# EAGLE design light-plate_control_v1.0 (EAGLE 6.2)

## Sheet 1 of 4
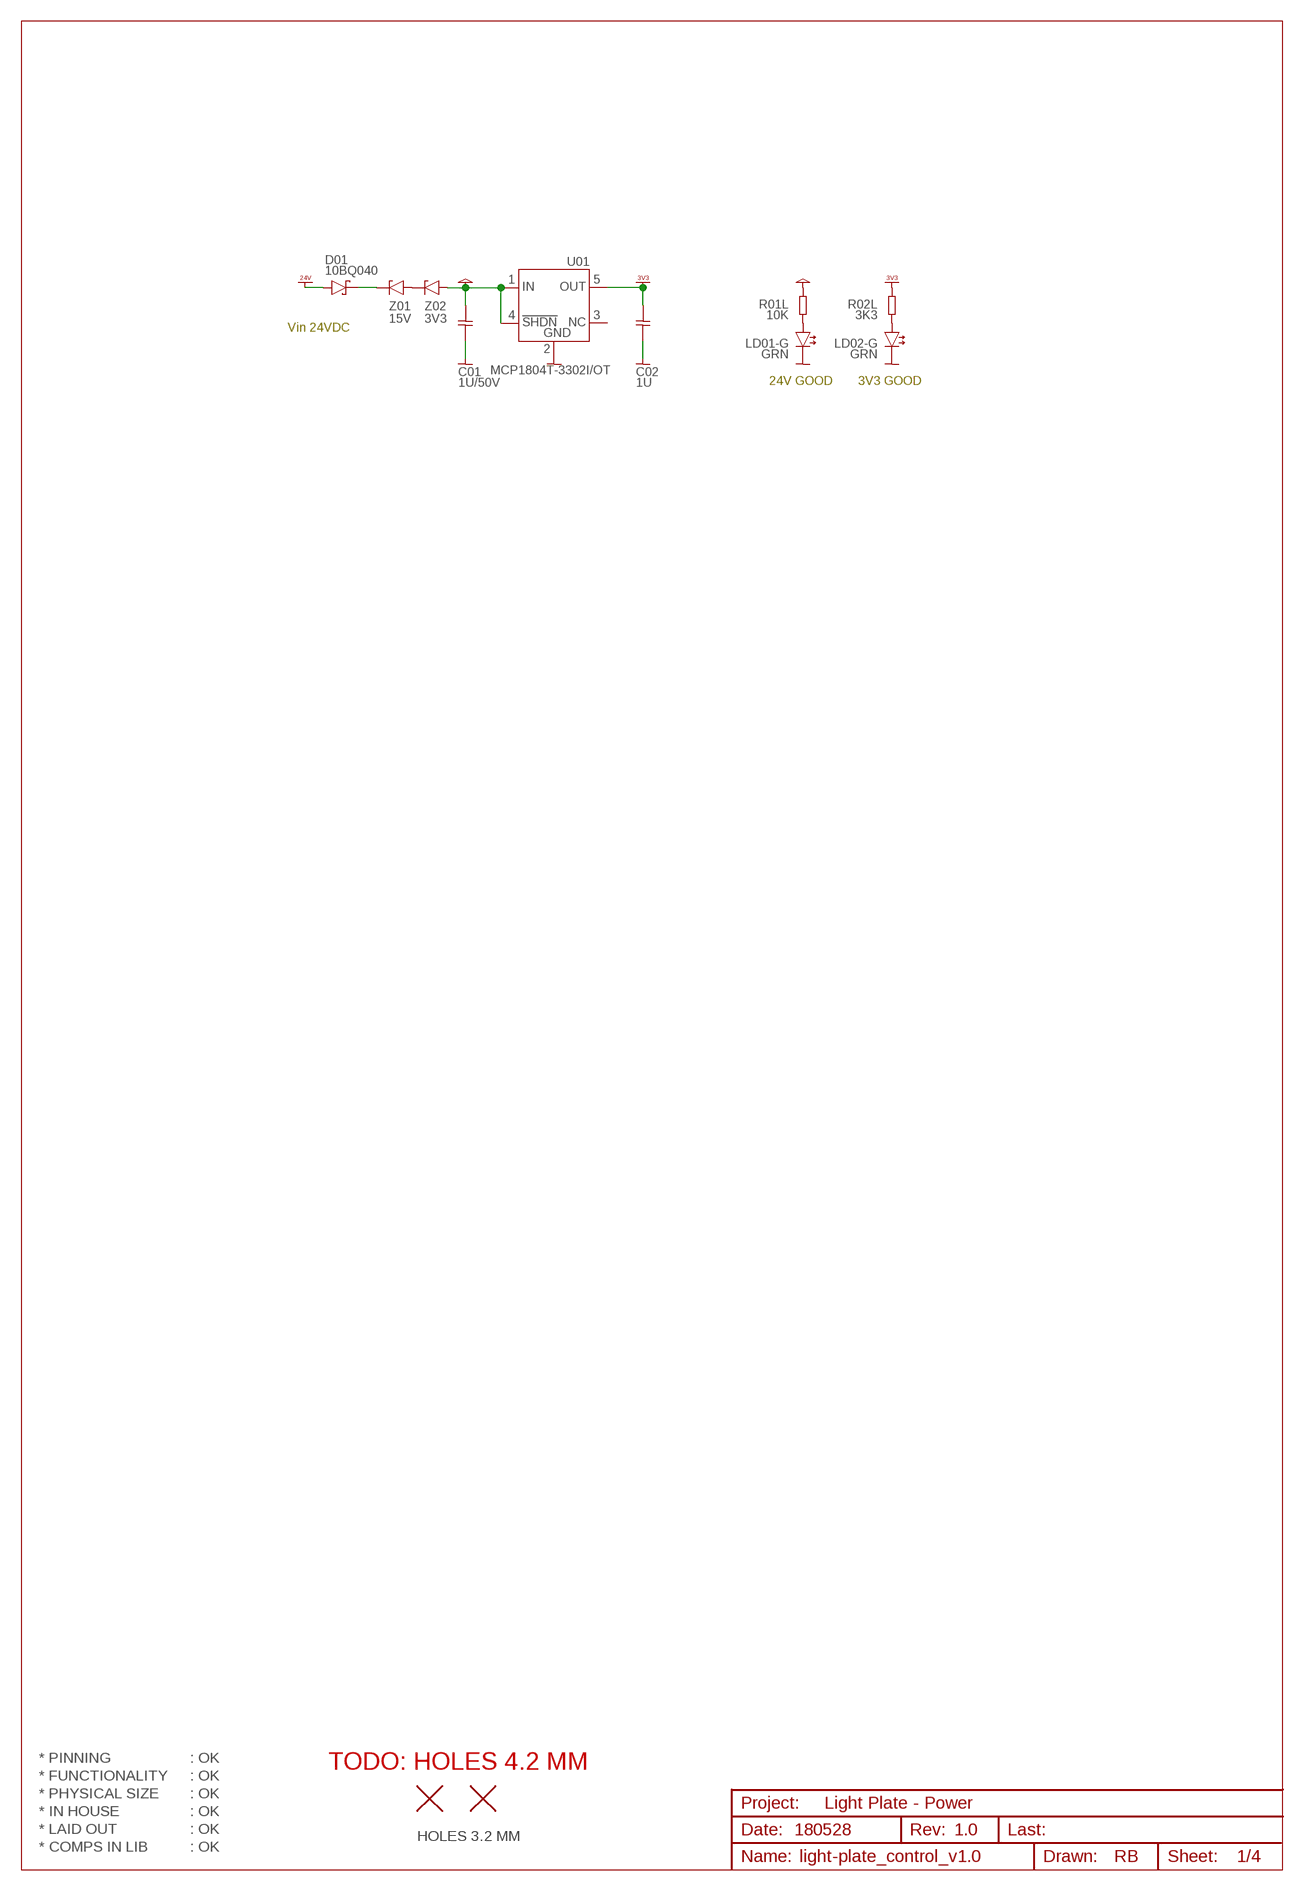
[diagram p0: schematic, sheet 1]

### Parts
C01  1U/50V  CAP0603  [CAP0603]
C02  1U  CAP0603  [CAP0603]
D01  10BQ040  DIODE_15MQ040  [DIODE_SMA]
H2  HOLE_NPTH_3.2MM  [HOLE_NPTH_3.2MM]
H3  HOLE_NPTH_3.2MM  [HOLE_NPTH_3.2MM]
LD01-G  GRN  LED_SMD_0603  [LED_SMD_0603]
LD02-G  GRN  LED_SMD_0603  [LED_SMD_0603]
R01L  10K  RES0603  [RES0603]
R02L  3K3  RES0603  [RES0603]
U01  MCP1804T-3302I/OT  [SOT23-5]
Z01  15V  ZENER_SOD80  [ZENER_SOD80]
Z02  3V3  ZENER_SOD80  [ZENER_SOD80]

### Nets
GND: C01.2 C02.2 LD01-G.C LD02-G.C U01.2(2.GND) ; also sheet 2,3,4
N$3: LD02-G.A R02L.2
N$25: LD01-G.A R01L.2
N$151: D01.C(-) Z01.2(-)
N$162: Z01.1(+) Z02.2(-)
VCC: C01.1 R01L.1 U01.1(1.IN) U01.4(4.SHDN) Z02.1(+)
VDD_3V3: C02.1 R02L.1 U01.5(5.OUT) ; supply symbol labelled VCC_3V3 ; also sheet 2
VDD_24V: D01.A(+) ; supply symbol labelled VCC_24V ; also sheet 2,3,4
Unconnected: U01.3(3.NC)

### Notes on the sheet
- Vin 24VDC
- 24V GOOD | 3V3 GOOD
- * PINNING | : OK
- TODO: HOLES 4.2 MM
- * FUNCTIONALITY | : OK
- * PHYSICAL SIZE | : OK
- Light Plate - Power
- * IN HOUSE | : OK
- * LAID OUT | : OK | 180528 | 1.0
- HOLES 3.2 MM
- * COMPS IN LIB | : OK

## Sheet 2 of 4
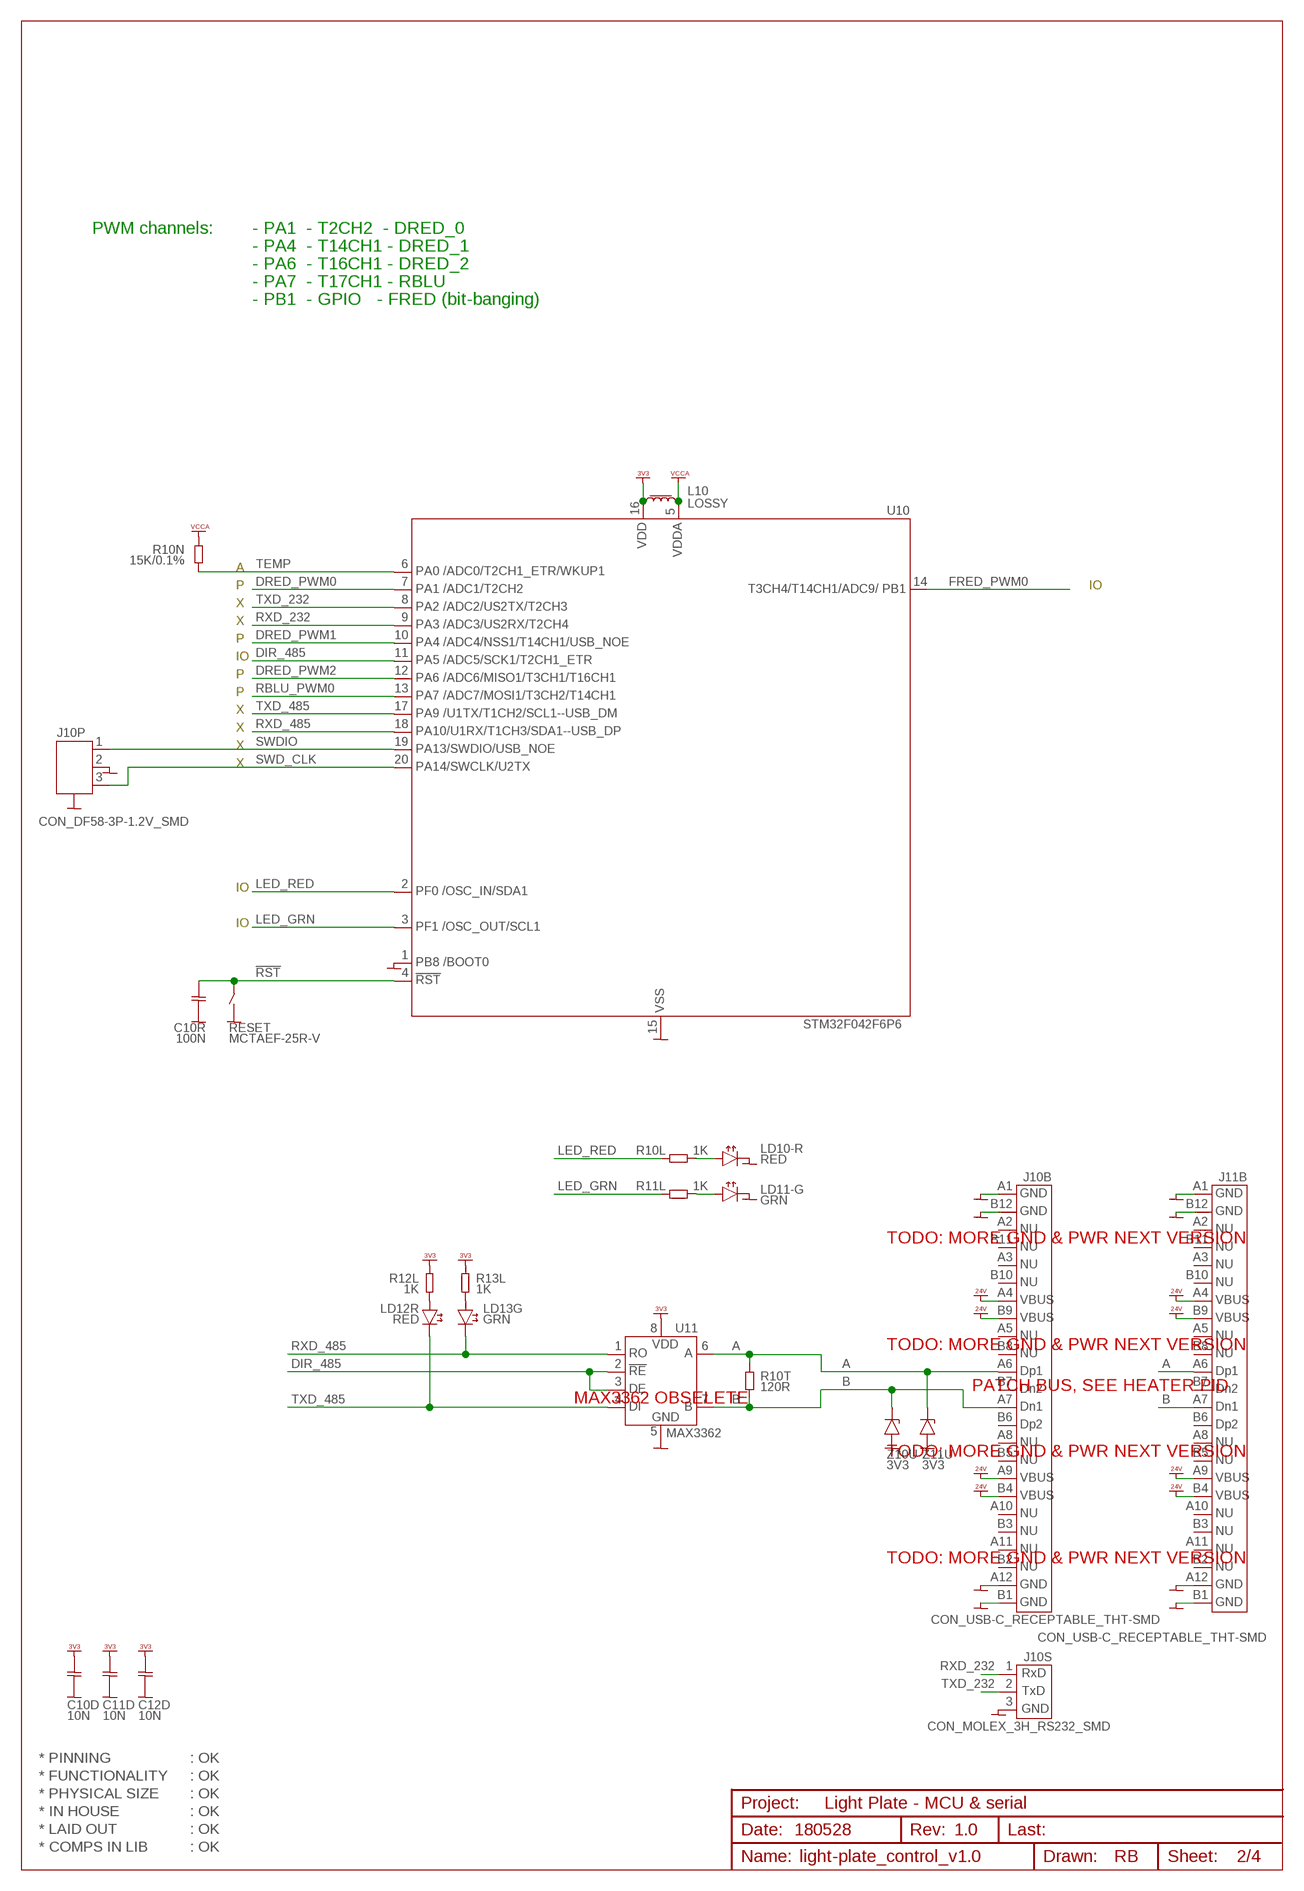
[diagram p1: schematic, sheet 2]

### Parts
C10D  10N  CAP0603  [CAP0603]
C10R  100N  CAP0603  [CAP0603]
C11D  10N  CAP0603  [CAP0603]
C12D  10N  CAP0603  [CAP0603]
J10B  CON_USB-C_RECEPTABLE_THT-SMD  [CON_USB-C_RECEPTABLE_THT-SMD]
J10P  CON_DF58-3P-1.2V_SMD  [CON_DF58-3P-1.2V_SMD]
J10S  CON_MOLEX_3H_RS232_SMD  [CON_MOLEX_3H+SMD]
J11B  CON_USB-C_RECEPTABLE_THT-SMD  [CON_USB-C_RECEPTABLE_THT-SMD]
L10  LOSSY  L_0603  [L_0603]
LD10-R  RED  LED_SMD_0603  [LED_SMD_0603]
LD11-G  GRN  LED_SMD_0603  [LED_SMD_0603]
LD12R  RED  LED_SMD_0603  [LED_SMD_0603]
LD13G  GRN  LED_SMD_0603  [LED_SMD_0603]
R10L  1K  RES0603  [RES0603]
R10N  15K/0.1%  RES0603  [RES0603]
R10T  120R  RES0603  [RES0603]
R11L  1K  RES0603  [RES0603]
R12L  1K  RES0603  [RES0603]
R13L  1K  RES0603  [RES0603]
RESET  MCTAEF-25R-V  SWITCH_PUSHBUTTON  [SWITCH_SMD_PBUTTON_2P]
U10  STM32F042F6P6  [TSSOP20]
U11  MAX3362  [SOT23-8]
Z10U  3V3  ZENER_SOD80  [ZENER_SOD80]
Z11U  3V3  ZENER_SOD80  [ZENER_SOD80]

### Nets
!RST: C10R.1 RESET.2(3-4) U10.4(4.!RST)
A: J10B.A6(A6.DP1) J11B.A6(A6.DP1) R10T.1 U11.6(6.A) Z11U.2(-)
B: J10B.A7(A7.DN1) J11B.A7(A7.DN1) R10T.2 U11.7(7.B) Z10U.2(-)
DIR_485: U10.11(11.PA5) U11.2(2.!RE) U11.3(3.DE)
DRED_PWM0: U10.7(7.PA1) ; also sheet 3
DRED_PWM1: U10.10(10.PA4) ; also sheet 3
DRED_PWM2: U10.12(12.PA6) ; also sheet 3
FRED_PWM0: U10.14(14.PB1) ; also sheet 4
GND: C10D.2 C10R.2 C11D.2 C12D.2 J10B.A1(A1.GND) J10B.A12(A12.GND) J10B.B1(B1.GND) J10B.B12(B12.GND) J10P.2 J10P.GND1 J10P.GND2 J10S.3 J11B.A1(A1.GND) J11B.A12(A12.GND) J11B.B1(B1.GND) J11B.B12(B12.GND) LD10-R.C LD11-G.C RESET.1(1-2) U10.1(1.BOOT0) U10.15(15.GND) U11.5(5.GND) Z10U.1(+) Z11U.1(+) ; also sheet 1,3,4
LED_GRN: R11L.1 U10.3(3.OSC_OUT)
LED_RED: R10L.1 U10.2(2.OSC_IN)
N$148: LD11-G.A R11L.2
N$149: LD10-R.A R10L.2
N$152: LD13G.A R13L.2
N$153: LD12R.A R12L.2
RBLU_PWM0: U10.13(13.PA7) ; also sheet 4
RXD_232: J10S.1 U10.9(9.PA3)
RXD_485: LD13G.C U10.18(18.PA10) U11.1(1.RO)
SWD_CLK: J10P.3 U10.20(20.PA14)
SWDIO: J10P.1 U10.19(19.PA13)
TEMP: R10N.1 U10.6(6.PA0)
TXD_232: J10S.2 U10.8(8.PA2)
TXD_485: LD12R.C U10.17(17.PA9) U11.4(4.DI)
VCCA: L10.2 R10N.2 U10.5(5.VDDA)
VDD_3V3: C10D.1 C11D.1 C12D.1 L10.1 R12L.1 R13L.1 U10.16(16.VDD) U11.8(8.VDD) ; supply symbol labelled VCC_3V3 ; also sheet 1
VDD_24V: J10B.A4(A4.VBUS) J10B.A9(A9.VBUS) J10B.B4(B4.VBUS) J10B.B9(B9.VBUS) J11B.A4(A4.VBUS) J11B.A9(A9.VBUS) J11B.B4(B4.VBUS) J11B.B9(B9.VBUS) ; supply symbol labelled VCC_24V ; also sheet 1,3,4
Unconnected: J10B.A2(A2.NU) J10B.A3(A3.NU) J10B.A5(A5.NU) J10B.A8(A8.NU) J10B.A10(A10.NU) J10B.A11(A11.NU) J10B.B2(B2.NU) J10B.B3(B3.NU) J10B.B5(B5.NU) J10B.B6(B6.DP2) J10B.B7(B7.DN2) J10B.B8(B8.NU) J10B.B10(B10.NU) J10B.B11(B11.NU) J11B.A2(A2.NU) J11B.A3(A3.NU) J11B.A5(A5.NU) J11B.A8(A8.NU) J11B.A10(A10.NU) J11B.A11(A11.NU) J11B.B2(B2.NU) J11B.B3(B3.NU) J11B.B5(B5.NU) J11B.B6(B6.DP2) J11B.B7(B7.DN2) J11B.B8(B8.NU) J11B.B10(B10.NU) J11B.B11(B11.NU)

### Notes on the sheet
- PWM channels: | - PA1  - T2CH2  - DRED_0
- - PA4  - T14CH1 - DRED_1
- - PA6  - T16CH1 - DRED_2
- - PA7  - T17CH1 - RBLU
- - PB1  - GPIO   - FRED (bit-banging)
- A
- P | IO
- X
- X
- P
- IO
- P
- P
- X
- X
- X
- X
- IO
- IO
- TODO: MORE GND & PWR NEXT VERSION
- TODO: MORE GND & PWR NEXT VERSION
- PATCH BUS, SEE HEATER PID
- MAX3362 OBSELETE
- TODO: MORE GND & PWR NEXT VERSION
- TODO: MORE GND & PWR NEXT VERSION
- * PINNING | : OK
- * FUNCTIONALITY | : OK
- * PHYSICAL SIZE | : OK
- Light Plate - MCU & serial
- * IN HOUSE | : OK
- * LAID OUT | : OK | 180528 | 1.0
- * COMPS IN LIB | : OK

## Sheet 3 of 4
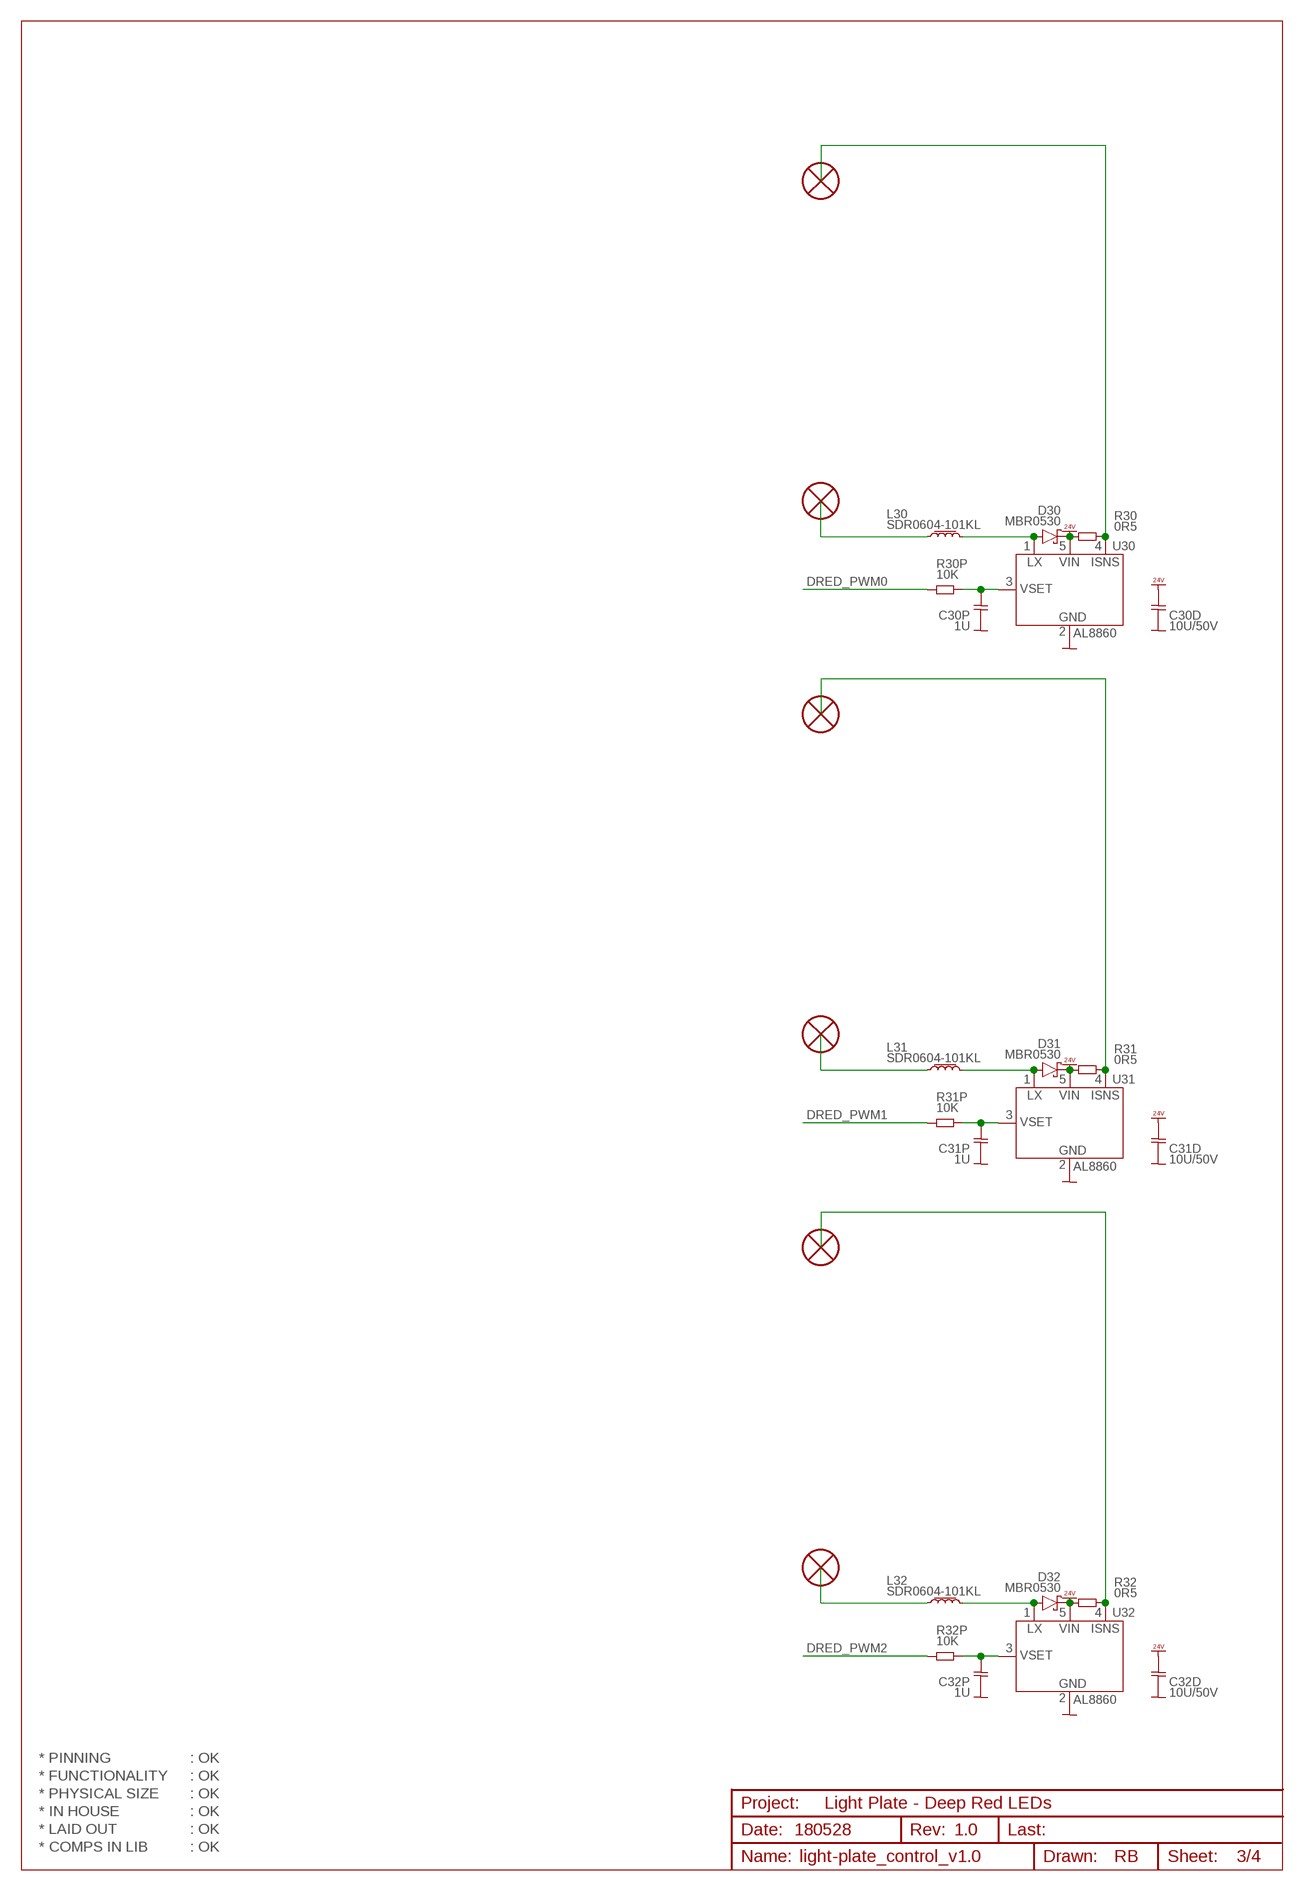
[diagram p2: schematic, sheet 3]

### Parts
C30D  10U/50V  CAP0603  [CAP0603]
C30P  1U  CAP0603  [CAP0603]
C31D  10U/50V  CAP0603  [CAP0603]
C31P  1U  CAP0603  [CAP0603]
C32D  10U/50V  CAP0603  [CAP0603]
C32P  1U  CAP0603  [CAP0603]
D30  MBR0530  DIODE_MBR0530  [DIODE_SOD123]
D31  MBR0530  DIODE_MBR0530  [DIODE_SOD123]
D32  MBR0530  DIODE_MBR0530  [DIODE_SOD123]
H5  HOLE_PTH_1.0MM  [HOLE_PTH_1.0MM]
H6  HOLE_PTH_1.0MM  [HOLE_PTH_1.0MM]
H7  HOLE_PTH_1.0MM  [HOLE_PTH_1.0MM]
H8  HOLE_PTH_1.0MM  [HOLE_PTH_1.0MM]
H9  HOLE_PTH_1.0MM  [HOLE_PTH_1.0MM]
H10  HOLE_PTH_1.0MM  [HOLE_PTH_1.0MM]
L30  SDR0604-101KL  L_SDR0604  [L_SDR0604]
L31  SDR0604-101KL  L_SDR0604  [L_SDR0604]
L32  SDR0604-101KL  L_SDR0604  [L_SDR0604]
R30  0R5  RES0603  [RES0603]
R30P  10K  RES0603  [RES0603]
R31  0R5  RES0603  [RES0603]
R31P  10K  RES0603  [RES0603]
R32  0R5  RES0603  [RES0603]
R32P  10K  RES0603  [RES0603]
U30  AL8860  [SOT23-5]
U31  AL8860  [SOT23-5]
U32  AL8860  [SOT23-5]

### Nets
DRED_PWM0: R30P.1 ; also sheet 2
DRED_PWM1: R31P.1 ; also sheet 2
DRED_PWM2: R32P.1 ; also sheet 2
GND: C30D.2 C30P.2 C31D.2 C31P.2 C32D.2 C32P.2 U30.2(2.GND) U31.2(2.GND) U32.2(2.GND) ; also sheet 1,2,4
N$12: C30P.1 R30P.2 U30.3(3.VSET)
N$138: H5.1 L30.1
N$139: H8.1 R31.2 U31.4(4.ISENSE)
N$140: D30.2(+) L30.2 U30.1(1.LX)
N$141: H6.1 R30.2 U30.4(4.ISENSE)
N$142: H7.1 L31.1
N$143: H10.1 R32.2 U32.4(4.ISENSE)
N$144: H9.1 L32.1
N$147: D31.2(+) L31.2 U31.1(1.LX)
N$154: C31P.1 R31P.2 U31.3(3.VSET)
N$155: D32.2(+) L32.2 U32.1(1.LX)
N$156: C32P.1 R32P.2 U32.3(3.VSET)
VDD_24V: C30D.1 C31D.1 C32D.1 D30.1-(-) D31.1-(-) D32.1-(-) R30.1 R31.1 R32.1 U30.5(5.VIN) U31.5(5.VIN) U32.5(5.VIN) ; supply symbol labelled VCC_24V ; also sheet 1,2,4

### Notes on the sheet
- * PINNING | : OK
- * FUNCTIONALITY | : OK
- * PHYSICAL SIZE | : OK
- Light Plate - Deep Red LEDs
- * IN HOUSE | : OK
- * LAID OUT | : OK | 180528 | 1.0
- * COMPS IN LIB | : OK

## Sheet 4 of 4
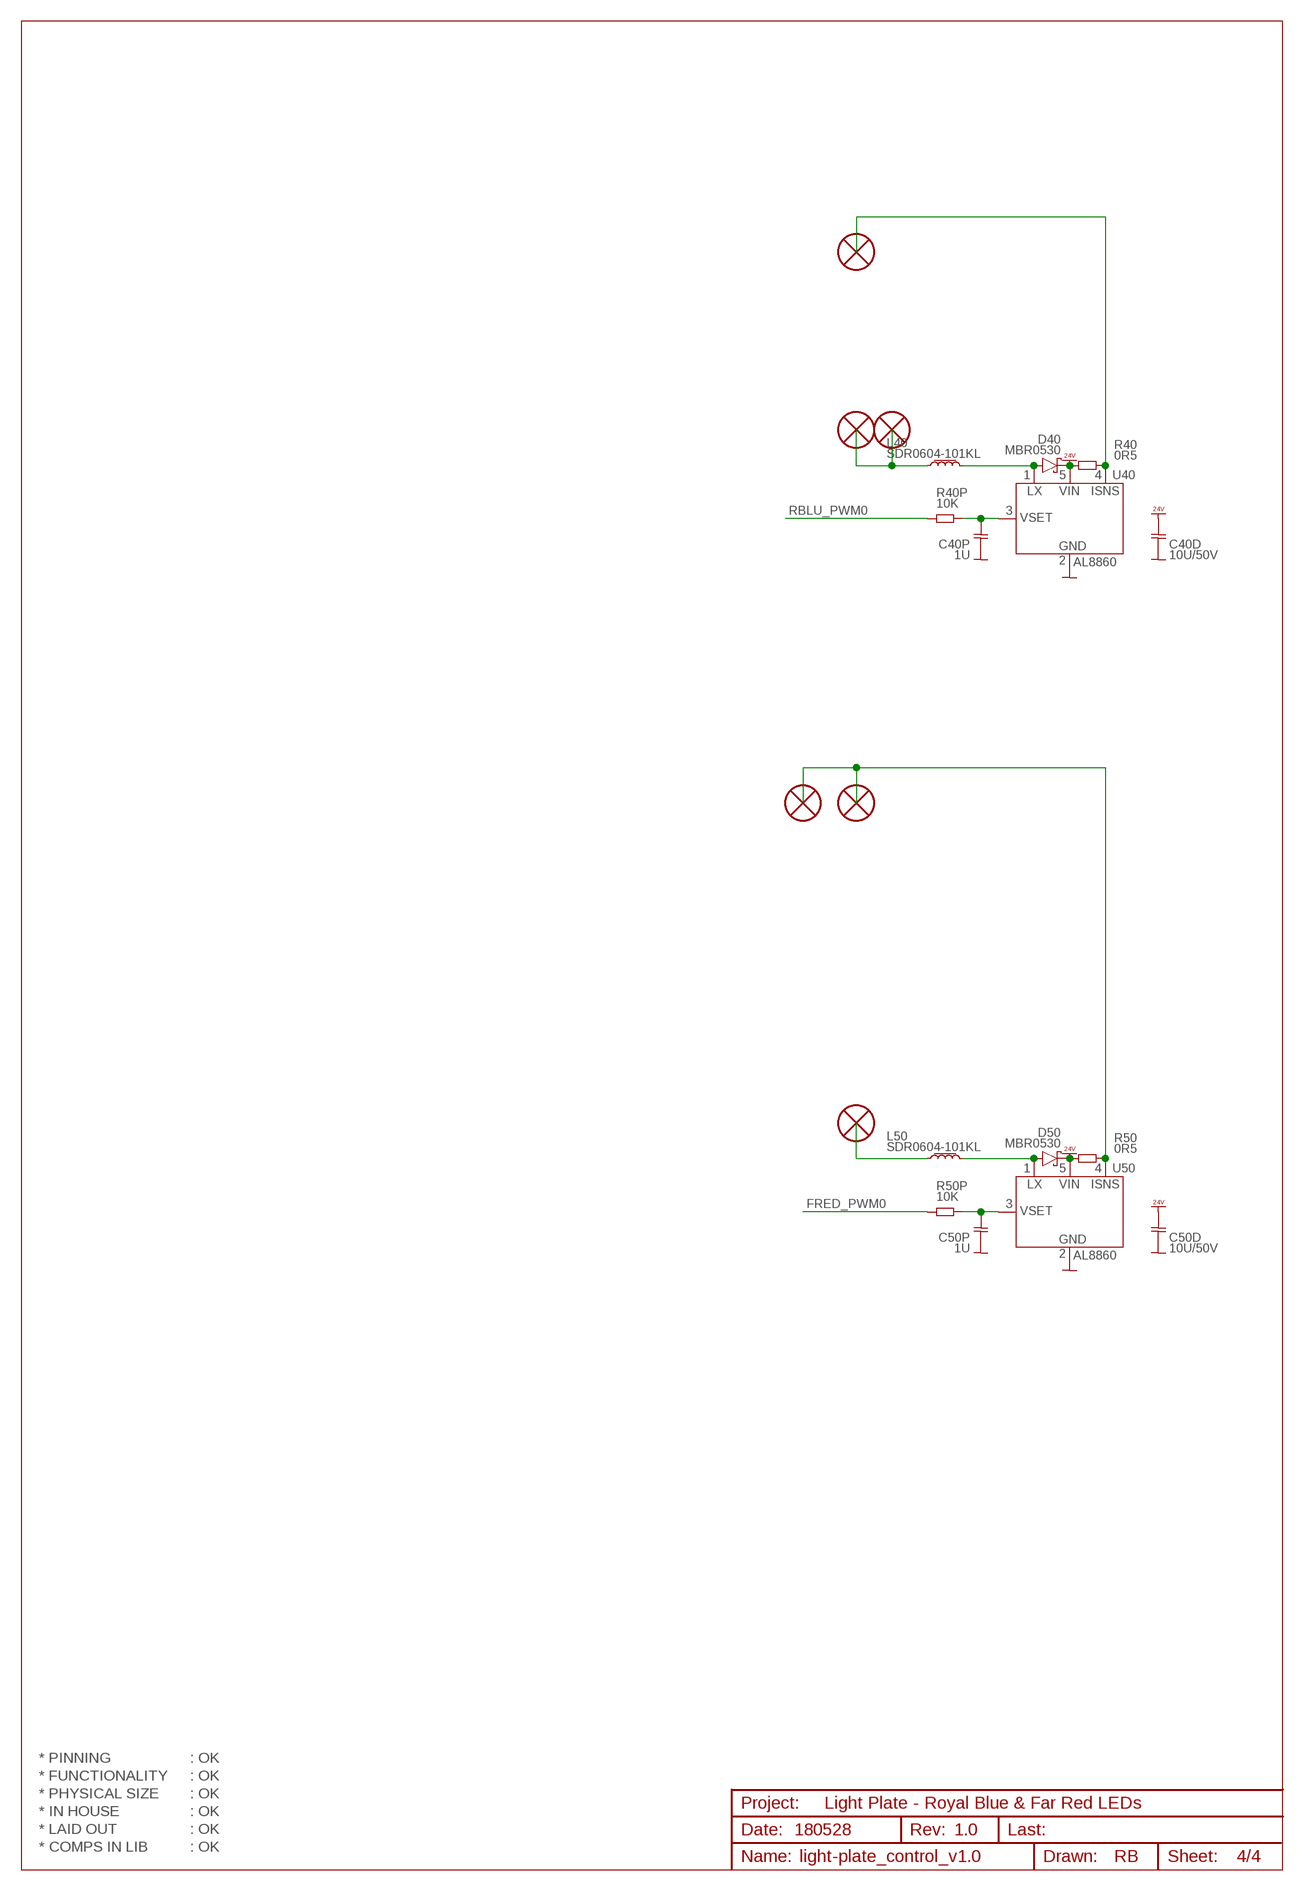
[diagram p3: schematic, sheet 4]

### Parts
C40D  10U/50V  CAP0603  [CAP0603]
C40P  1U  CAP0603  [CAP0603]
C50D  10U/50V  CAP0603  [CAP0603]
C50P  1U  CAP0603  [CAP0603]
D40  MBR0530  DIODE_MBR0530  [DIODE_SOD123]
D50  MBR0530  DIODE_MBR0530  [DIODE_SOD123]
H11  HOLE_PTH_1.0MM  [HOLE_PTH_1.0MM]
H12  HOLE_PTH_1.0MM  [HOLE_PTH_1.0MM]
H13  HOLE_PTH_1.0MM  [HOLE_PTH_1.0MM]
H14  HOLE_PTH_1.0MM  [HOLE_PTH_1.0MM]
H15  HOLE_PTH_1.0MM  [HOLE_PTH_1.0MM]
H16  HOLE_PTH_1.0MM  [HOLE_PTH_1.0MM]
L40  SDR0604-101KL  L_SDR0604  [L_SDR0604]
L50  SDR0604-101KL  L_SDR0604  [L_SDR0604]
R40  0R5  RES0603  [RES0603]
R40P  10K  RES0603  [RES0603]
R50  0R5  RES0603  [RES0603]
R50P  10K  RES0603  [RES0603]
U40  AL8860  [SOT23-5]
U50  AL8860  [SOT23-5]

### Nets
FRED_PWM0: R50P.1 ; also sheet 2
GND: C40D.2 C40P.2 C50D.2 C50P.2 U40.2(2.GND) U50.2(2.GND) ; also sheet 1,2,3
N$145: H11.1 H15.1 L40.1
N$146: H12.1 R40.2 U40.4(4.ISENSE)
N$150: H14.1 H16.1 R50.2 U50.4(4.ISENSE)
N$157: D50.2(+) L50.2 U50.1(1.LX)
N$158: C50P.1 R50P.2 U50.3(3.VSET)
N$159: H13.1 L50.1
N$160: D40.2(+) L40.2 U40.1(1.LX)
N$161: C40P.1 R40P.2 U40.3(3.VSET)
RBLU_PWM0: R40P.1 ; also sheet 2
VDD_24V: C40D.1 C50D.1 D40.1-(-) D50.1-(-) R40.1 R50.1 U40.5(5.VIN) U50.5(5.VIN) ; supply symbol labelled VCC_24V ; also sheet 1,2,3

### Notes on the sheet
- * PINNING | : OK
- * FUNCTIONALITY | : OK
- * PHYSICAL SIZE | : OK
- Light Plate - Royal Blue & Far Red LEDs
- * IN HOUSE | : OK
- * LAID OUT | : OK | 180528 | 1.0
- * COMPS IN LIB | : OK

## Library data of the parts
C01 C02 C10D C10R C11D C12D C30D C30P C31D C31P C32D C32P C40D C40P C50D C50P = 00-own_parts:CAP0603: Capacitor, ceramic, 0603
D01 = 00-own_parts:DIODE_15MQ040: Diode, Schottky, 15MQ040, 40V/3A, SMA, F# 165-1114
D30-D32 D40 D50 = 00-own_parts:DIODE_MBR0530: Doide, Schottky, MBR0503, 30V/0A5, SOD-123, F#: 143-1036
H2 H3 = 00-own_parts:HOLE_NPTH_3.2MM: Hole, NPTH, 3.2mm
H5-H16 = 00-own_parts:HOLE_PTH_1.0MM: Hole, PTH, 1.0mm
J10B J11B = 00-own_parts:CON_USB-C_RECEPTABLE_THT-SMD: Connector, DB25, male, straight, wirewarp, press nuts, DK#: 2625FA-ND
J10P = 00-own_parts:CON_DF58-3P-1.2V_SMD: Connector, DF58, 3 way, 1,2mm pitch, SMD
J10S = 00-own_parts:CON_MOLEX_3H_RS232_SMD: Connector, RS232, 3p, SMD pads
L10 = 00-own_parts:L_0603: Inductor, 0603, chip ferrite bead
L30-L32 L40 L50 = 00-own_parts:L_SDR0604: Inductor, Bourns SDR0604
LD01-G LD02-G LD10-R LD11-G LD12R LD13G = 00-own_parts:LED_SMD_0603: LED, SMD, 0603
R01L R02L R10L R10N R10T R11L R12L R13L R30 R30P R31 R31P R32 R32P R40 R40P R50 R50P = 00-own_parts:RES
RESET = 00-own_parts:SWITCH_PUSHBUTTON: Switch, push button, SPNO, MCTAEF, F# 160-5485
U01 = 00-own_parts:MCP1804T-3302I/OT: Regulator, LDO w. enable, Vin=2.0..28V, Vout=3V3, Vdrop = 260mV, SOT23-5,
U10 = 00-own_parts:STM32F042F6P6: MCU, low power, ARM Cortex M0, 32-bit, 48 MHz, 32 kB Flash, 6 kB SRAM, 8 kB EEPROM, RTC, xtal-less USB, ADC, cap. touch sensing, TSSOP20
U11 = 00-own_parts:MAX3362: Transceiver, RS485/422, 3V3, SOT23-8
U30-U32 U40 U50 = 00-own_parts:AL8860: DC/DC converter, step-down, LED driver, 40V/1A, TSOT25
Z01 Z02 Z10U Z11U = 00-own_parts:ZENER_SOD80: Zener, generic SOD80

## Board
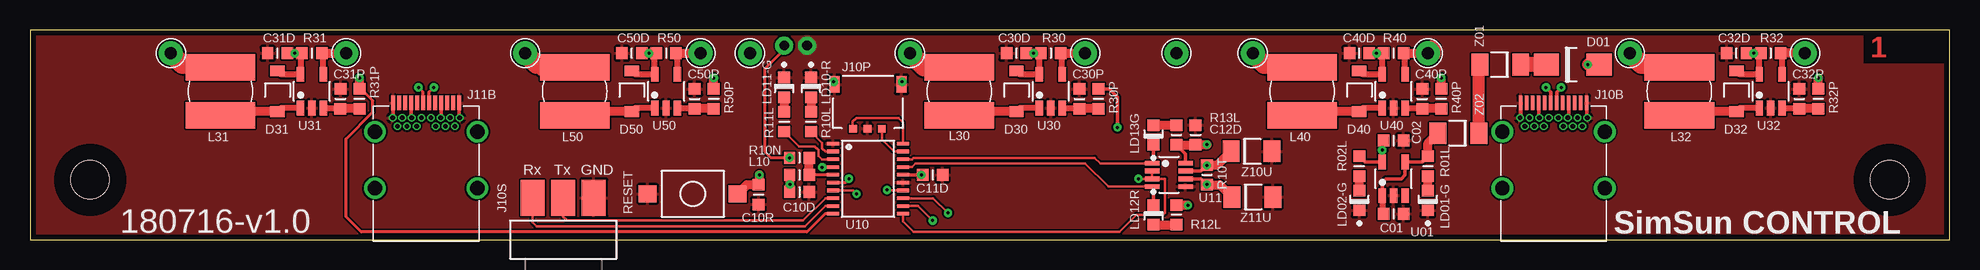
[diagram p4: board, top side]
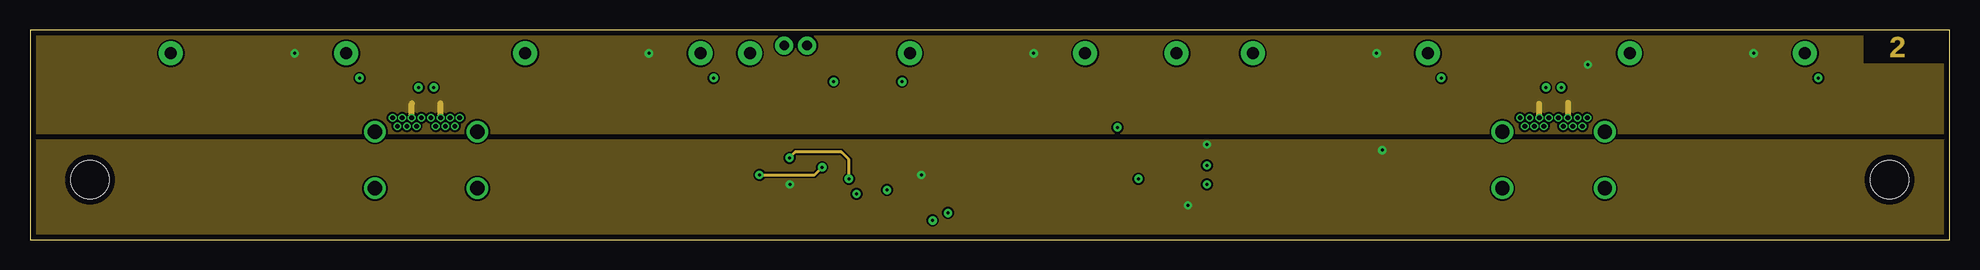
[diagram p5: board, inner layer Route2]
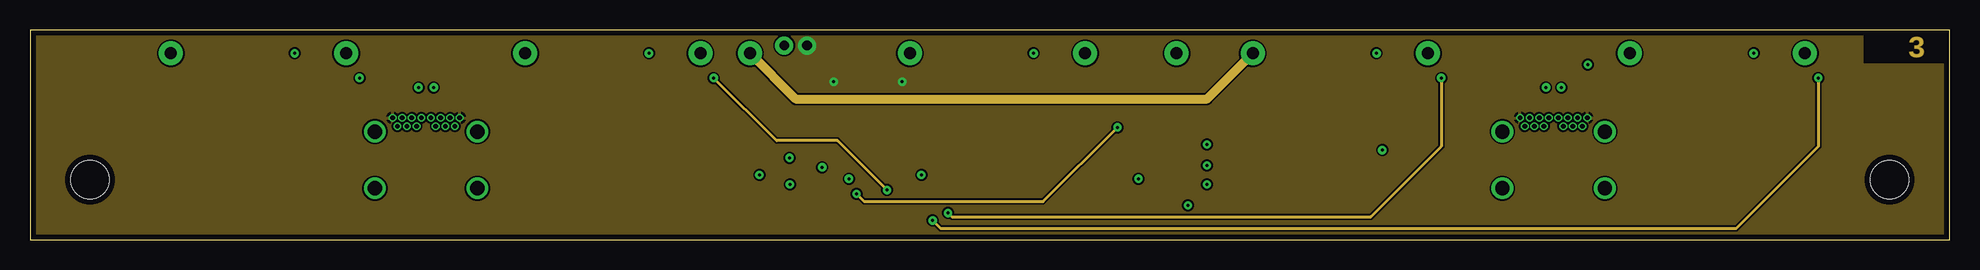
[diagram p6: board, inner layer Route15]
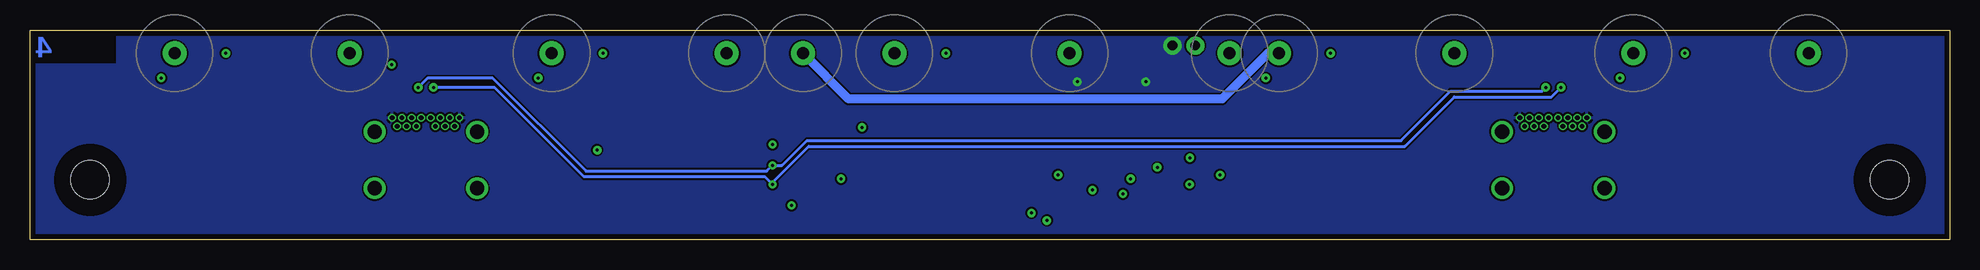
[diagram p7: board, bottom side, seen from below]

Size 160 x 17.5 mm. Coordinates in mm from the lower left corner, seen from the top.
Outline: 0,0 160,0 160,17.5 0,17.5 0,0
Copper layers (1*2*15*16): Top 0.018mm / dielectric 0.36mm / Route2 0.035mm / dielectric 0.71mm / Route15 0.035mm / dielectric 0.2mm / Bottom 0.018mm
Design rules: minimum track width 0.15mm, minimum drill 0.25mm, track to track 0.15mm, track to pad 0.15mm, pad to pad 0.15mm, via to via 0.15mm, smd to smd 0mil, copper to edge 0.45mm, drill to drill 0.3mm, minimum pad ring 0.125mm, minimum via ring 0.2mm, stop-mask expansion 0.1mm, vias tented up to drill 0.5mil, thermal gap 0.2mm

### Footprints (pad centres in the part's own frame; a part is rotated, then mirrored left to right if it is on the bottom)
CAP0603 = smd 0.95 x 1: 1 -0.821,0.002; 2 0.822,0
DIODE_SMA = smd 2.1 x 1.8: A -2.2,0; C 2.2,0
DIODE_SOD123 = smd 0.9 x 1.2: 1- -1.7,0; 2 1.7,0
HOLE_NPTH_3.2MM = hole 3.2: 0,0
HOLE_PTH_1.0MM = drill 1 pad 2: 1 0,0
CON_USB-C_RECEPTABLE_THT-SMD = smd 0.3 x 1.2: A1 -2.75,1.25; A2 -2.25,1.25; A3 -1.75,1.25; A4 -1.25,1.25; A5 -0.75,1.25; A6 -0.25,1.25; A7 0.25,1.25; A8 0.75,1.25; A9 1.25,1.25; A10 1.75,1.25; A11 2.25,1.25; A12 2.75,1.25 | drill 0.4 pad 0.65: B1 2.8,0; B2 2.4,-0.7; B3 1.6,-0.7; B4 1.2,0; B5 0.8,-0.7; B6 0.4,0; B7 -0.4,0; B8 -0.8,-0.7; B9 -1.2,0; B10 -1.6,-0.7; B11 -2.4,-0.7; B12 -2.8,0; BG1 2,0; BG2 -2,0 | drill 1.2 pad 1.8: C1 -4.27,-5.88; C2 4.27,-5.88; C3 -4.27,-1.15; C4 4.27,-1.15
CON_DF58-3P-1.2V_SMD = smd 0.65 x 0.6: 1 -1.15,4.4; 2 0.05,4.4; 3 1.25,4.4 | smd 0.85 x 1.4: GND1 -2.8,0.7; GND2 2.8,0.7
CON_MOLEX_3H+SMD = smd 2 x 3: 1 -2.54,0; 2 0,0; 3 2.54,0
L_0603 = smd 0.95 x 1: 1 -0.821,0.002; 2 0.822,0
L_SDR0604 = smd 2.2 x 5.8: 1 -2,0; 2 2,0
LED_SMD_0603 = smd 0.95 x 1: A -0.827,0; C 0.827,0
RES0603 = smd 0.95 x 1: 1 -0.821,0.002; 2 0.822,0
SWITCH_SMD_PBUTTON_2P = smd 1.5 x 1.4: 1 -3.75,0; 2 3.75,0
SOT23-5 = smd 0.62 x 1.22: 1 -0.95,-1.4; 2 0,-1.4; 3 0.95,-1.4; 4 0.95,1.4; 5 -0.95,1.4
TSSOP20 = smd 0.305 x 0.991: 1 -2.925,-2.918; 2 -2.275,-2.918; 3 -1.625,-2.918; 4 -0.975,-2.918; 5 -0.325,-2.918; 6 0.325,-2.918; 7 0.975,-2.918; 8 1.625,-2.918; 9 2.275,-2.918; 10 2.925,-2.918; 11 2.925,2.918; 12 2.275,2.918; 13 1.625,2.918; 14 0.975,2.918; 15 0.325,2.918; 16 -0.325,2.918; 17 -0.975,2.918; 18 -1.625,2.918; 19 -2.275,2.918; 20 -2.925,2.918
SOT23-8 = smd 0.4 x 1.22: 1 -0.975,-1.4; 2 -0.325,-1.4; 3 0.325,-1.4; 4 0.975,-1.4; 5 0.975,1.4; 6 0.325,1.4; 7 -0.325,1.4; 8 -0.975,1.4
ZENER_SOD80 = smd 1.4 x 1.8: 1 -1.7,0; 2 1.7,0

### Placement (x,y rotation side)
C01  113.67,2.15 0 top
C02  113.67,8.26 0 top
C10D  64.14,3.97 0 top
C10R  60.72,3.75 270 top
C11D  75.25,5.4 0 top
C12D  97.16,8.73 90 top
C30D  82.23,15.56 180 top
C30P  87.47,11.75 90 top
C31D  20.64,15.56 180 top
C31P  25.88,11.75 90 top
C32D  142.24,15.56 180 top
C32P  147.48,11.75 90 top
C40D  110.81,15.56 180 top
C40P  116.05,11.75 90 top
C50D  50.16,15.56 180 top
C50P  55.4,11.75 90 top
D01  128.59,14.61 180 top
D30  82.23,12.38 270 top
D31  20.64,12.38 270 top
D32  142.24,12.38 270 top
D40  110.81,12.38 270 top
D50  50.16,12.38 270 top
H2  5,5 0 top
H3  155,5 0 top
H5  73.34,15.56 0 top
H6  87.95,15.56 0 top
H7  11.75,15.56 0 top
H8  26.35,15.56 0 top
H9  133.35,15.56 90 top
H10  147.96,15.56 90 top
H11  101.92,15.56 0 top
H12  116.52,15.56 0 top
H13  41.27,15.56 0 top
H14  55.88,15.56 0 top
H15  60.01,15.56 0 top
H16  95.57,15.56 0 top
J10B  127,10.16 0 top
J10P  69.85,13.65 180 top
J10S  44.45,3.49 0 top
J11B  33.02,10.16 0 top
L10  64.14,5.4 0 top
L30  77.47,12.38 270 top
L31  15.88,12.38 270 top
L32  137.48,12.38 270 top
L40  106.05,12.38 270 top
L50  45.4,12.38 270 top
LD01-G  116.51,3.27 270 top
LD02-G  110.8,3.27 270 top
LD10-R  65.09,12.7 90 top
LD11-G  62.87,12.7 90 top
LD12R  93.66,2.06 90 top
LD13G  93.66,8.73 270 top
R01L  116.51,6.12 270 top
R02L  110.8,6.12 270 top
R10L  65.09,9.84 90 top
R10N  64.14,6.83 0 top
R10T  98.11,5.4 90 top
R11L  62.87,9.84 90 top
R12L  95.57,2.06 270 top
R13L  95.56,8.73 90 top
R30  85.09,15.56 0 top
R30P  89.06,11.75 270 top
R31  23.5,15.56 0 top
R31P  27.46,11.75 270 top
R32  145.1,15.56 0 top
R32P  149.07,11.75 270 top
R40  113.67,15.56 0 top
R40P  117.63,11.75 270 top
R50  53.02,15.56 0 top
R50P  56.99,11.75 270 top
RESET  55.24,3.81 0 top
U01  113.67,5.08 0 top
U10  69.85,5.08 270 top
U11  94.93,5.4 270 top
U30  85.09,12.38 0 top
U31  23.5,12.38 0 top
U32  145.1,12.38 0 top
U40  113.67,12.38 0 top
U50  53.02,12.38 0 top
Z01  122.56,14.61 0 top
Z02  119.06,8.89 0 top
Z10U  101.82,7.36 180 top
Z11U  101.9,3.55 180 top

### Tracks (layer width: path | path; a pad name or v marks a point on that pad's centre or on a via)
!RST  (via drill 0.25 pad 0.7)
  Top 0.203: U10.4 66.06,6.05 v66.04,6.03 | 60.8,4.65 C10R.1
  Top 0.762: v60.8,5.4 60.8,4.57 C10R.1 59.76,4.57 RESET.2
  Route2 0.254: v60.8,5.4 65.41,5.4 v66.04,6.03
A  (via drill 0.25 pad 0.7)
  Top 0.254: J11B.A6 32.77,12.31 v32.38,12.7 | R10T.1 v98.11,4.6
  Top 0.305: U11.6 97.61,5.07 R10T.1 | J10B.A6 126.75,12.31 v126.36,12.7
  Top 0.762: R10T.1 99.17,4.58 Z11U.2
  Bottom 0.254: v32.38,12.7 33.18,11.91 41.27,11.91 45.4,7.78 95.09,7.78 98.11,4.76 v98.11,4.6 98.74,5.24 113.82,5.24 121.28,12.7 v126.36,12.7
B  (via drill 0.25 pad 0.7)
  Top 0.254: J11B.A7 33.27,12.31 v33.66,12.7 | v98.11,6.19 98.08,6.19 98.01,6.13
  Top 0.305: U11.7 97.61,5.72 98.01,6.13 R10T.2 | J10B.A7 127.25,12.31 v127.64,12.7
  Top 0.762: R10T.2 98.97,6.22 Z10U.2
  Bottom 0.254: v33.66,12.7 33.97,12.38 41.59,12.38 45.72,8.26 95.25,8.26 97.31,6.19 v98.11,6.19 98.58,5.71 113.67,5.71 121.44,13.49 126.84,13.49 v127.64,12.7
DIR_485  (via drill 0.25 pad 0.7)
  Top 0.203: U11.3 U11.2 | U11.3 v92.4,5.07 v92.39,5.08 | U11.3 94.61,5.08 94.61,2.22 94.46,2.06 92.23,2.06 90.81,0.64 73.66,0.64 72.77,1.53 U10.11
DRED_PWM0  (via drill 0.25 pad 0.7)
  Top 0.203: R30P.1 | U10.7 68.6,4.11 v68.9,3.81
  Top 0.305: v90.65,9.37 90.65,11.91 89.98,12.57 R30P.1
  Route15 0.254: v68.9,3.81 69.53,3.17 84.45,3.17 v90.65,9.37
DRED_PWM1  (via drill 0.25 pad 0.7)
  Top 0.203: 27.47,12.7 R31P.1
  Top 0.254: 27.47,12.7 28.57,11.59 28.57,10.64 26.35,8.41 26.35,1.91 27.62,0.64 64.77,0.64 66.29,2.15 U10.10
  Top 0.762: 27.47,12.7 v27.47,13.49 v27.46,13.49
DRED_PWM2  (via drill 0.25 pad 0.7)
  Top 0.203: R32P.1 | U10.12 74.03,2.81 v75.25,1.59
  Top 0.762: R32P.1 v149.07,13.49
  Route15 0.254: v75.25,1.59 75.88,0.95 142.24,0.95 149.07,7.78 v149.07,13.49
FRED_PWM0  (via drill 0.25 pad 0.7)
  Top 0.203: U10.14 71.46,4.11 v71.44,4.13
  Top 0.762: R50P.1 v56.99,13.49
  Route15 0.254: v71.44,4.13 67.31,8.26 62.23,8.26 v56.99,13.49
GND  (via drill 0.25 pad 0.7, 0.8 pad 1.5)
  Top 0.305: J10B.A1 124.25,10.27 124.14,10.16 | J10B.A12 129.75,10.27 129.86,10.16 | J11B.A1 30.27,10.27 30.16,10.16 | J11B.A12 35.77,10.27 35.88,10.16
  other vias: 66.99,13.18 72.71,13.18 64.77,16.19
  pour Top (rank 2): 0,0 0,17.47 152.72,17.46 152.71,14.61 160.03,14.61 160.03,0
  pour Route15: 0,0 0,17.46 152.72,17.46 152.72,14.61 160.02,14.61 160.02,0
  pour Bottom: 0,0 0,17.46 152.72,17.46 152.72,14.61 160.02,14.61 160.02,0
LED_GRN
  Top 0.203: R11L.1 64.11,7.78 65.41,7.78 65.72,7.46 65.72,6.99 66,6.71 U10.3
LED_RED
  Top 0.203: R10L.1 66.04,8.07 66.04,7.62 66.31,7.36 U10.2
N$3
  Top 0.762: LD02-G.A R02L.2
N$12
  Top 0.508: U30.3 87.41,10.98 C30P.1
  Top 0.762: R30P.2 C30P.1
N$25
  Top 0.762: LD01-G.A R01L.2
N$138
  Top 1.524: H5.1 74.52,14.38 L30.1
N$139
  Top 0.508: U31.4 24.45,15.43 R31.2
  Top 0.762: R31.2 H8.1
N$140
  Top 0.508: U30.1 82.53,10.98 D30.2
  Top 0.762: D30.2 77.77,10.68 L30.2
N$141
  Top 0.508: U30.4 86.04,15.43 R30.2
  Top 0.762: R30.2 H6.1
N$142
  Top 1.524: H7.1 12.7,14.61 15.65,14.61 L31.1
N$143
  Top 0.508: U32.4 146.05,15.43 R32.2
  Top 0.762: H10.1 R32.2
N$144
  Top 1.524: H9.1 134.3,14.61 137.48,14.61 L32.1
N$145
  Top 1.524: H11.1 102.87,14.61 105.82,14.61 L40.1
  Route15 0.762: H15.1 63.82,11.75 98.11,11.75 H11.1
N$146
  Top 0.508: U40.4 114.61,15.55 114.62,15.56
  Top 0.762: R40.2 114.62,15.56 H12.1
  Top 1.524: H12.1 116.84,15.88 116.84,15.56
N$147
  Top 0.508: U31.1 20.94,10.98 D31.2
  Top 0.762: D31.2 16.18,10.68 L31.2
N$148
  Top 0.762: LD11-G.A R11L.2
N$149
  Top 0.762: LD10-R.A R10L.2
N$150
  Top 0.508: U50.4 53.97,15.55 53.98,15.56
  Top 0.762: R50.2 53.98,15.56 H14.1
  Bottom 0.762: H14.1 56.83,15.56 60.64,11.75 91.76,11.75 H16.1
N$151
  Top 1.27: D01.C Z01.2
N$152
  Top 0.762: LD13G.A R13L.2
N$153
  Top 0.762: LD12R.A R12L.2
N$154
  Top 0.508: U31.3 25.82,10.98 C31P.1
  Top 0.762: R31P.2 C31P.1
N$155
  Top 0.508: U32.1 142.54,10.98 D32.2
  Top 0.762: D32.2 137.78,10.68 L32.2
N$156
  Top 0.508: U32.3 147.58,10.98 147.64,10.93
  Top 0.762: R32P.2 147.64,10.93 C32P.1
N$157
  Top 0.508: U50.1 50.47,10.98 D50.2
  Top 0.762: D50.2 45.7,10.68 L50.2
N$158
  Top 0.508: U50.3 55.35,10.98 C50P.1
  Top 0.762: R50P.2 C50P.1
N$159
  Top 1.524: H13.1 42.23,14.61 42.55,14.61 42.77,14.38 L50.1
N$160
  Top 0.508: 110.95,10.82 D40.2 111.11,10.98 U40.1
  Top 0.762: D40.2 106.34,10.68 L40.2
N$161
  Top 0.508: U40.3 115.99,10.98 C40P.1
  Top 0.762: R40P.2 C40P.1
N$162
  Top 1.016: Z02.2 120.76,14.51 Z01.1
RBLU_PWM0  (via drill 0.25 pad 0.7)
  Top 0.203: R40P.1 | U10.13 75.28,3.46 v76.52,2.22
  Top 0.762: R40P.1 v117.63,13.49
  Route15 0.254: v76.52,2.22 76.83,1.91 111.76,1.91 117.63,7.78 v117.63,13.49
RXD_232
  Top 0.203: U10.9 66.31,2.81 64.61,1.11 42.23,1.11 41.91,1.43 J10S.1
RXD_485
  Top 0.203: U11.1 93.51,6.35 89.22,6.35 88.74,6.83 73.66,6.83 73.54,6.71 U10.18
  Top 0.305: LD13G.C 93.66,6.5 U11.1
SWD_CLK
  Top 0.203: U10.20 72.77,9.78 72.39,10.16 68.9,10.16 68.58,9.84 68.58,9.27 J10P.3
SWDIO
  Top 0.203: U10.19 72.02,7.36 71,8.38 J10P.1
TEMP  (via drill 0.25 pad 0.7, 0.8 pad 1.5)
  Top 0.254: U10.6 67.94,4.75 v68.26,5.08 | R10N.1 61.75,6.83 61.28,7.3 61.28,14.29 62.87,15.88 v62.87,16.19
  Route2 0.254: v68.26,5.08 68.26,6.67 67.63,7.3 63.79,7.3 R10N.1
  other vias: 63.31,6.83
TXD_232
  Top 0.203: U10.8 66.32,3.46 64.45,1.59 44.77,1.59 44.45,1.91 J10S.2
TXD_485
  Top 0.203: U10.17 73.52,6.05 73.82,6.35 87.95,6.35 89.88,4.42 U11.4
  Top 0.305: U11.4 93.66,4.42 LD12R.C
VCC
  Top 0.305: U01.1 112.72,4.76 113.03,5.08 114.3,5.08 114.61,5.39 U01.4 116.05,6.48 R01L.1
  Top 0.508: U01.1 112.72,2.28 C01.1
  Top 0.762: R01L.1 116.52,6.95 116.52,8.05 Z02.1
VCCA
  Top 0.203: 66.94,5.4 U10.5
  Top 0.254: L10.2 U10.5 67.3,5.41 67.31,5.4
  Top 0.305: 64.96,5.53 65.09,5.4 L10.2
  Top 0.762: 64.96,5.53 R10N.2
VDD_3V3  (via drill 0.25 pad 0.7)
  Top 0.254: R02L.1 110.81,6.95
  Top 0.305: U01.5 111.26,6.48 R02L.1 | C11D.1 v74.3,5.4 74.29,5.41 U10.16 | U11.8 96.33,7.13 R13L.1
  Top 0.508: U01.5 v112.71,7.46 112.71,8.13 C02.1
  Top 0.762: R13L.1 C12D.1 97.18,7.94 v98.11,7.94 | R12L.1 96.49,2.88 v96.52,2.86 | C10D.1 63.31,4.58 v63.34,4.6 63.31,4.63 L10.1
  pour Route2: 0,0 0,8.26 160.02,8.26 160.02,0
VDD_24V  (via drill 0.25 pad 0.7)
  Top 0.305: J10B.A9 128.25,10.21 J10B.B4 | J10B.A4 125.75,10.21 J10B.B9 | J11B.A9 34.27,10.21 J11B.B4 | J11B.A4 31.77,10.21 J11B.B9
  Top 0.508: D31.1- 20.94,13.78 U31.5 22.55,15.56 R31.1 | D50.1- 50.47,13.78 U50.5 52.07,15.43 R50.1 | D32.1- 142.54,13.78 U32.5 144.15,15.56 | D40.1- 111.11,13.78 U40.5 112.71,15.56 | D30.1- 82.53,13.78 U30.5 84.14,15.43 R30.1
  Top 0.762: C32D.1 v143.67,15.56 144.15,15.56 R32.1 | C30D.1 v83.66,15.56 84.01,15.56 84.14,15.43 | C40D.1 v112.24,15.56 112.71,15.56 R40.1 | C31D.1 v22.07,15.56 22.55,15.56 | C50D.1 v51.59,15.56 51.95,15.56 52.07,15.43
  Top 1.016: D01.A v129.86,14.61
  Route2 0.508: 128.2,11.43 J10B.B4 | J10B.B9 125.8,11.34 | J11B.B9 31.82,11.36 | J11B.B4 34.22,11.36
  pour Route2: 0,8.89 0,17.46 152.72,17.46 152.72,14.61 160.02,14.61 160.02,8.89

### Text on the board
Top: 1
Route2: 2
Route15: 3
Bottom: 4
tPlace: Rx | Tx | GND | 180716-v1.0 | SimSun CONTROL